# Altium schematic sheet power supply.SchDoc
size A3
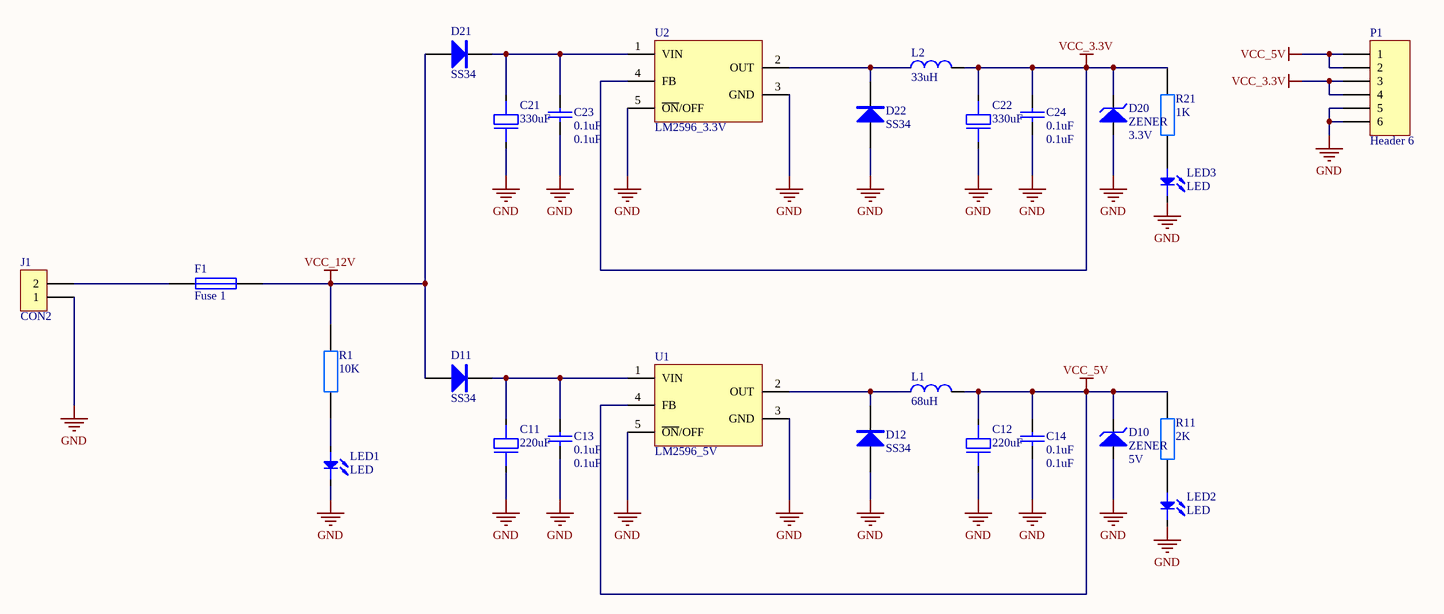
[diagram p0: power supply.SchDoc]

## Parts
C11  220uF  [SMD-EC-F10]
C12  220uF  [SMD-EC-F10]
C13  0.1uF  [0805C]
C14  0.1uF  [0805C]
C21  330uF  [SMD-EC-F10]
C22  330uF  [SMD-EC-F10]
C23  0.1uF  [0805C]
C24  0.1uF  [0805C]
D10  ZENER  value 5V  [1206D]
D11  SS34  [SMA]
D12  SS34  [SMA]
D20  ZENER  value 3.3V  [1206D]
D21  SS34  [SMA]
D22  SS34  [SMA]
F1  Fuse 1  [FUSE1]
J1  CON2  [con2]
L1  68uH  [12x12]
L2  33uH  [12x12]
LED1  LED  [3528 led]
LED2  LED  [3528 led]
LED3  LED  [3528 led]
P1  Header 6  [HDR1X6]
R1  10K  [0805]
R11  2K  [0805]
R21  1K  [0805]
U1  LM2596_5V  [TO-263]
U2  LM2596_3.3V  [to-263]

## Nets
GND: C11.2 C12.2 C13.2 C14.2 C21.2 C22.2 C23.2 C24.2 D10.1(A) D12.1(A) D20.1(A) D22.1(A) J1.1 LED1.2 LED2.2 LED3.2 P1.5 P1.6 U1.3(GND) U1.5(~{ON}/OFF) U2.3(GND) U2.5(~{ON}/OFF)
VCC_3.3V: C22.1 C24.1 D20.2(K) L2.1 P1.3 P1.4 R21.2 U2.4(FB)
VCC_5V: C12.1 C14.1 D10.2(K) L1.1 P1.1 P1.2 R11.2 U1.4(FB)
VCC_12V: D11.1(A) D21.1(A) F1.2 R1.2
NetC11_1: C11.1 C13.1 D11.2(K) U1.1(VIN)
NetC21_1: C21.1 C23.1 D21.2(K) U2.1(VIN)
NetD12_2: D12.2(K) L1.2 U1.2(OUT)
NetD22_2: D22.2(K) L2.2 U2.2(OUT)
NetF1_1: F1.1 J1.2
NetLED1_1: LED1.1 R1.1
NetLED2_1: LED2.1 R11.1
NetLED3_1: LED3.1 R21.1

## Library data of the parts
C11 C12 C21 C22 = Electrolytic CAP
  C11 C12: VALUE: 220uF
  C21 C22: VALUE: 330uF
C13 C14 C23 C24 = CAP: VALUE: 0.1uF
D11 D12 D21 D22 = SS14: Diode
F1 = Fuse 1: Fuse; Published: 8-Jun-2000; LatestRevisionDate: 17-Jul-2002; LatestRevisionNote: Re-released for DXP Platform.; PackageReference: PIN-W2/E2.8; Publisher: Altium Limited; PackageDescription: Thru-Hole; 2 Leads
L1 L2 = Inductance
  L1: value: 68uH
  L2: value: 33uH
P1 = Header 6: Header, 6-Pin; LatestRevisionDate: 17-Jul-2002; LatestRevisionNote: Re-released for DXP Platform.; Publisher: Altium Limited
R1 R11 R21 = RES
  R1: VALUE: 10K
  R11: VALUE: 2K
  R21: VALUE: 1K
U1 U2 = LM2596: IC-power